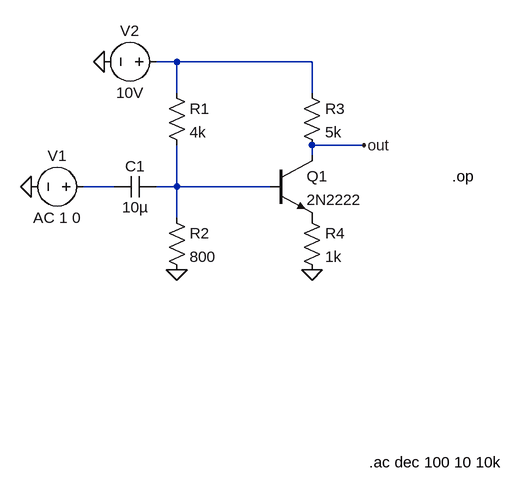
[diagram p0: schematic PNP.asc]
PNP.asc, the LTspice schematic file:
Version 4
SHEET 1 880 680
WIRE 192 16 160 16
WIRE 400 16 192 16
WIRE 192 64 192 16
WIRE 400 64 400 16
WIRE 480 144 400 144
WIRE 400 160 400 144
WIRE 96 208 48 208
WIRE 192 208 192 144
WIRE 192 208 160 208
WIRE 336 208 192 208
WIRE 192 256 192 208
FLAG 480 144 out
FLAG 192 336 0
FLAG 400 336 0
FLAG -32 208 0
FLAG 80 16 0
SYMBOL res 176 48 R0
SYMATTR InstName R1
SYMATTR Value 4k
SYMBOL res 176 240 R0
SYMATTR InstName R2
SYMATTR Value 800
SYMBOL res 384 48 R0
SYMATTR InstName R3
SYMATTR Value 5k
SYMBOL res 384 240 R0
SYMATTR InstName R4
SYMATTR Value 1k
SYMBOL npn 336 160 R0
SYMATTR InstName Q1
SYMATTR Value 2N2222
SYMBOL voltage 64 208 R90
WINDOW 0 -32 56 VBottom 2
WINDOW 3 32 56 VTop 2
SYMATTR InstName V1
SYMATTR Value AC 1 0
SYMBOL cap 160 192 R90
WINDOW 0 0 32 VBottom 2
WINDOW 3 32 32 VTop 2
SYMATTR InstName C1
SYMATTR Value 10µ
SYMBOL voltage 176 16 R90
WINDOW 0 -32 56 VBottom 2
WINDOW 3 32 56 VTop 2
SYMATTR InstName V2
SYMATTR Value 10V
TEXT 616 192 Left 2 !.op
TEXT 488 632 Left 2 !.ac dec 100 10 10k

The netlist it stands for:
* PNP.asc
R1 N001 N003 4k
R2 N003 0 800
R3 N001 out 5k
R4 P001 0 1k
Q1 out N003 P001 0 2N2222
V1 N002 0 AC 1 0
C1 N003 N002 10µ
V2 N001 0 10V
.model NPN NPN
.model PNP PNP
.lib standard.bjt
.op
.ac dec 100 10 10k
.backanno
.end